# Altium schematic sheet Analog.SchDoc
size A4
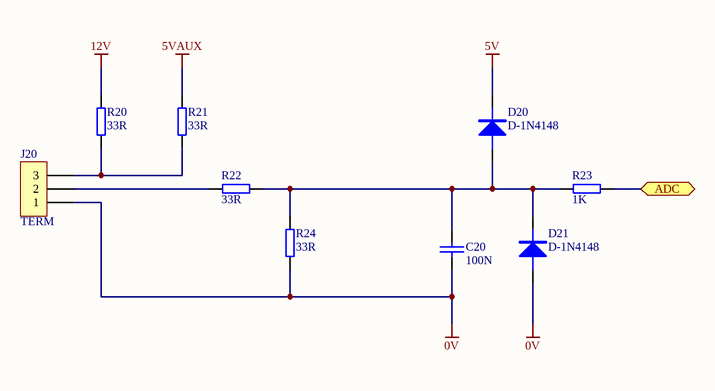
[diagram p0: Analog.SchDoc]

## Parts
C20  100N  [AXIAL02]
D20  D-1N4148  [DO35S]
D21  D-1N4148  [DO35S]
J20  TERM  [MKD500S3]
R20  33R  [AXIAL04]
R21  33R  [AXIAL04]
R22  33R  [AXIAL04]
R23  1K  [AXIAL04]
R24  33R  [AXIAL04]

## Ports
ADC

## Nets
0V: C20.2 D21.1(A) J20.1 R24.1
5V: D20.2(K)
5VAUX: R21.2
12V: R20.2
ADC: R23.2 ; port ADC
NetC20_1: C20.1 D20.1(A) D21.2(K) R22.1 R23.1 R24.2
NetJ20_2: J20.2 R22.2
NetJ20_3: J20.3 R20.1 R21.1

## Library data of the parts
C20 = C-B100N: CAPACITOR
D20 D21 = D-1N4148: 1N4148
J20 = J-SCR-3: CONNECTOR
R20-R22 R24 = R-A33R: RESISTOR; Detail: *; Order: *; Cost: *
R23 = R-A1K: RESISTOR; Detail: *; Order: *; Cost: *